# EAGLE design IX01 (EAGLE 6.3)
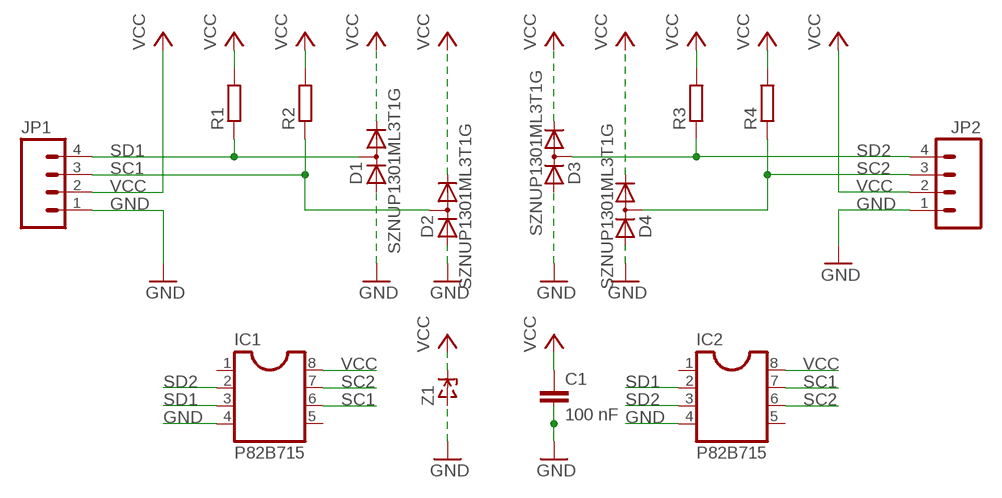
[diagram p0: schematic, sheet 1]

## Parts
C1  100 nF  C-EUC0805  [C0805]
D1  SZNUP1301ML3T1G  BAV199  [SOT23]
D2  SZNUP1301ML3T1G  BAV199  [SOT23]
D3  SZNUP1301ML3T1G  BAV199  [SOT23]
D4  SZNUP1301ML3T1G  BAV199  [SOT23]
IC1  P82B715  IC_DIL8-SO8  [SO-8]
IC2  P82B715  IC_DIL8-SO8  [SO-8]
JP1  M04PTH  [1X04]
JP2  M04PTH  [1X04]
R1  R-EU_R0805  [R0805]
R2  R-EU_R0805  [R0805]
R3  R-EU_R0805  [R0805]
R4  R-EU_R0805  [R0805]
Z1  ZENERSOD-323F  [SOD-323F]

## Nets
GND: C1.2 D1.1(A) D2.1(A) D3.1(A) D4.1(A) IC1.4 IC2.4 JP1.1 JP2.1 Z1.A
SC1: D2.3(AC) IC1.6 IC2.7 JP1.3 R2.1
SC2: D4.3(AC) IC1.7 IC2.6 JP2.3 R4.1
SD1: D1.3(AC) IC1.3 IC2.2 JP1.4 R1.1
SD2: D3.3(AC) IC1.2 IC2.3 JP2.4 R3.1
VCC: C1.1 D1.2(C) D2.2(C) D3.2(C) D4.2(C) IC1.8 IC2.8 JP1.2 JP2.2 R1.2 R2.2 R3.2 R4.2 Z1.C
Unconnected: IC1.1 IC1.5 IC2.1 IC2.5

## Library data of the parts
C1 = rcl:C-EU: CAPACITOR, European symbol
D1-D4 = diode:BAV199: DIODE low-leakage double diode
IC1 IC2 = dp_devices:IC_DIL8: Universal 8pins IC
JP1 JP2 = SparkFun:M04: Header 4 Standard 4-pin 0.1" header. Use with straight break away headers (SKU : PRT-00116), right angle break away headers (PRT-00553), swiss pins (PRT-00743), machine pins (PRT-00117), and female headers (PRT-00115). Molex polarized connector foot print use with SKU : PRT-08231 with associated crimp pins and housings. 1MM SMD Version SKU: PRT-10208
R1-R4 = rcl:R-EU_: RESISTOR, European symbol
Z1 = dp_devices:ZENER: Zener Diode SOD-323

## Board
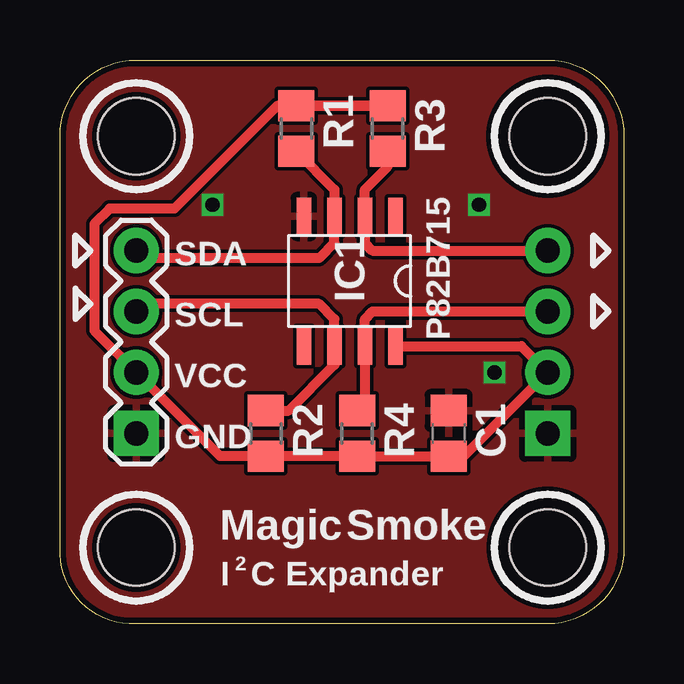
[diagram p1: board, top side]
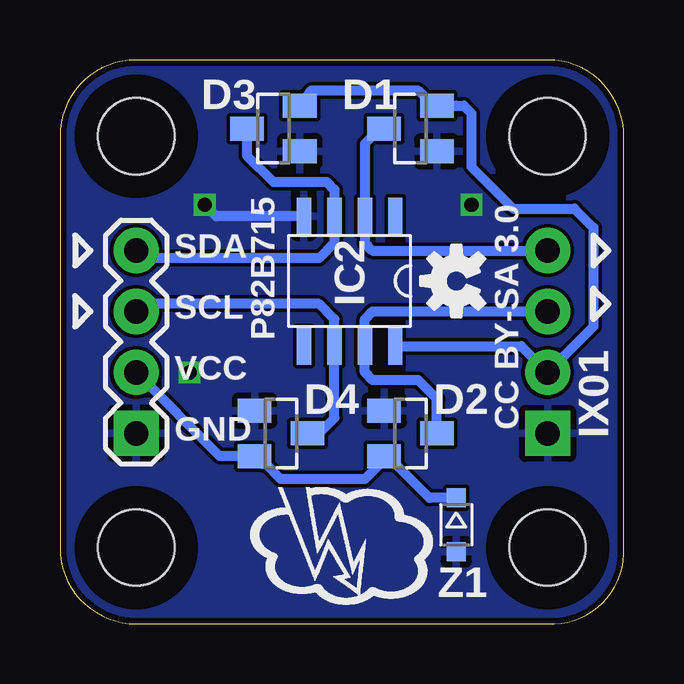
[diagram p2: board, bottom side, seen from below]

Size 23.5 x 23.5 mm. Coordinates in mm from the lower left corner, seen from the top.
Outline: 0,3.18 0,20.32 arc-90 3.18,23.5 20.32,23.5 arc-90 23.5,20.32 23.5,3.18 arc-90 20.32,0 3.18,0 arc-96 0,3.18
Copper layers (1*2*15*16): Top 0.035mm / dielectric 0.2mm / layer 2 0.0175mm / dielectric 1.1mm / layer 15 0.0175mm / dielectric 0.2mm / Bottom 0.035mm
Design rules "SeeedStudio_DRU_no_angle_20130527": minimum track width 6mil, minimum drill 12mil, track to track 6mil, track to pad 6mil, pad to pad 6mil, via to via 6mil, smd to smd 0mil, copper to edge 10mil, drill to drill 10mil, minimum pad ring 6mil, minimum via ring 6mil, stop-mask expansion 2mil, vias tented up to drill 25mil, thermal gap 10mil
Holes 3.17 mm at 20.32,3.18 20.32,20.32 3.18,3.18 3.18,20.32
tRestrict: area 17.8,17.8 to 22.9,22.9; area 17.8,0.6 to 22.9,5.7
bRestrict: area 17.8,17.8 to 22.9,22.9; area 17.8,0.6 to 22.9,5.7; area 0.6,0.6 to 5.7,5.7; area 0.6,17.8 to 5.7,22.9

### Footprints (pad centres in the part's own frame; a part is rotated, then mirrored left to right if it is on the bottom)
C0805 = smd 1.3 x 1.5: 1 -0.95,0; 2 0.95,0
SOT23 = smd 1 x 1.4: 1 -0.95,-1.1; 2 0.95,-1.1; 3 0,1.1
SO-8 = smd 0.6 x 1.55: 1 -1.905,-2.69; 2 -0.635,-2.69; 3 0.635,-2.69; 4 1.905,-2.69; 5 1.905,2.71; 6 0.635,2.71; 7 -0.635,2.71; 8 -1.905,2.71
1X04 = drill 1.016 pad 1.88 square: 1 0,0 | drill 1.016 pad 1.88: 2 2.54,0; 3 5.08,0; 4 7.62,0
R0805 = smd 1.3 x 1.5: 1 -0.95,0; 2 0.95,0
SOD-323F = smd 0.8 x 0.8: A 1.125,0; C -1.125,0

### Placement (x,y rotation side)
C1  16.19,7.94 90 top
D1  8.89,20.64 90 bottom
D2  8.89,7.94 270 bottom
D3  14.61,20.64 90 bottom
D4  14.29,7.94 270 bottom
IC1  12.07,14.29 180 top
IC2  11.43,14.29 180 bottom
JP1  3.18,7.94 90 top
JP2  20.32,7.94 90 bottom
R1  9.84,20.64 90 top
R2  8.57,7.94 270 top
R3  13.65,20.64 90 top
R4  12.38,7.94 270 top
U$3  [OSHW-LOGO-S]  6.99,14.29 90 bottom
Z1  6.99,4.13 270 bottom

### Tracks (layer width: path | path; a pad name or v marks a point on that pad's centre or on a via)
GND  (via drill 0.6)
  Top 0.406: C1.2
  Bottom 0.406: IC2.4 16.98,16.98 v17.46,17.46
  other vias: 6.35,17.46 18.1,10.48
  pour Top: -0.63,24.13 24.13,24.13 24.13,-0.63 -0.63,-0.63
  pour Bottom: -0.32,23.81 23.81,23.81 23.81,-0.32 -0.32,-0.32
SC1
  Top 0.406: JP1.3 3.49,13.34 10.8,13.34 11.43,12.7 IC1.6 11.43,10.8 9.53,8.89 R2.1
  Bottom 0.406: JP1.3 10.48,13.02 10.8,12.7 IC2.7 10.8,10.48 10.48,10.16 8.57,10.16 7.79,9.38 D2.3
SC2
  Top 0.406: JP2.3 13.02,13.02 12.7,12.7 IC1.7 12.7,9.53 R4.1
  Bottom 0.406: JP2.3 20,13.34 12.7,13.34 12.07,12.7 IC2.6 12.07,8.57 12.7,7.94 D4.3
SD1
  Top 0.406: R1.1 11.43,18.1 IC1.3 11.43,15.88 10.8,15.24 3.49,15.24 JP1.4
  Bottom 0.406: JP1.4 10.48,15.56 10.8,15.88 IC2.2 10.8,20 10.16,20.64 D1.3
SD2
  Top 0.406: R3.1 13.65,19.05 12.7,18.1 IC1.2 12.7,15.88 13.02,15.56 JP2.4
  Bottom 0.406: JP2.4 20,15.24 12.7,15.24 12.07,15.88 IC2.3 12.07,18.1 12.38,18.42 14.61,18.42 15.71,19.52 D3.3
VCC
  Top 0.406: R1.2 R3.2 9.05,21.59 4.76,17.31 2.07,17.31 1.43,16.67 1.43,12.23 JP1.2 6.67,6.99 R2.2 R4.2 C1.1 16.83,6.99 JP2.2 19.22,11.58 IC1.8
  Bottom 0.406: IC2.8 4.28,11.58 JP1.2 1.27,12.38 1.27,16.51 2.07,17.31 4.61,17.31 6.35,19.05 6.35,21.27 6.67,21.59 6.99,21.59 7.94,21.59 | D1.2 7.94,21.59 | 13.02,22.23 D3.2 13.34,21.59 13.02,22.23 | JP2.2 16.83,6.99 D4.2 15.07,6.67 14.92,6.67 14.29,6.03 10.8,6.03 9.99,6.84 D2.2 9.84,6.99 8.11,5.25 Z1.C | 13.02,22.23 8.57,22.23 7.94,21.59

### Text on the board
tPlace: SDA | SCL | VCC | GND | Magic | Smoke | I | 2 | C Expander
bPlace: CC BY-SA 3.0 | SDA | SCL | IX01 | VCC | GND